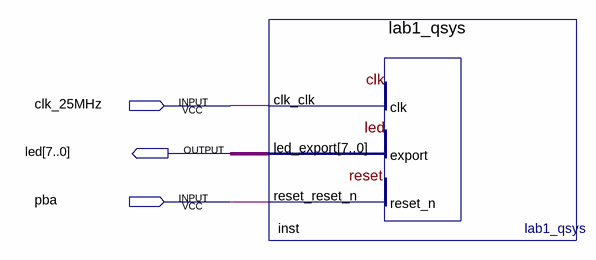
[diagram p0: schematic sheet]
// Quartus schematic lab1.bdf as structural Verilog: 1 symbols, 3 pins
module lab1 (
  input  clk_25MHz,
  input  pba,
  output [7:0] led
);

  lab1_qsys inst (.clk_clk(clk_25MHz), .reset_reset_n(pba), .led_export(led));
endmodule
